# Altium schematic sheet controle_motor_official.SchDoc
size A4; SheetNumber: 1; SheetTotal: 4
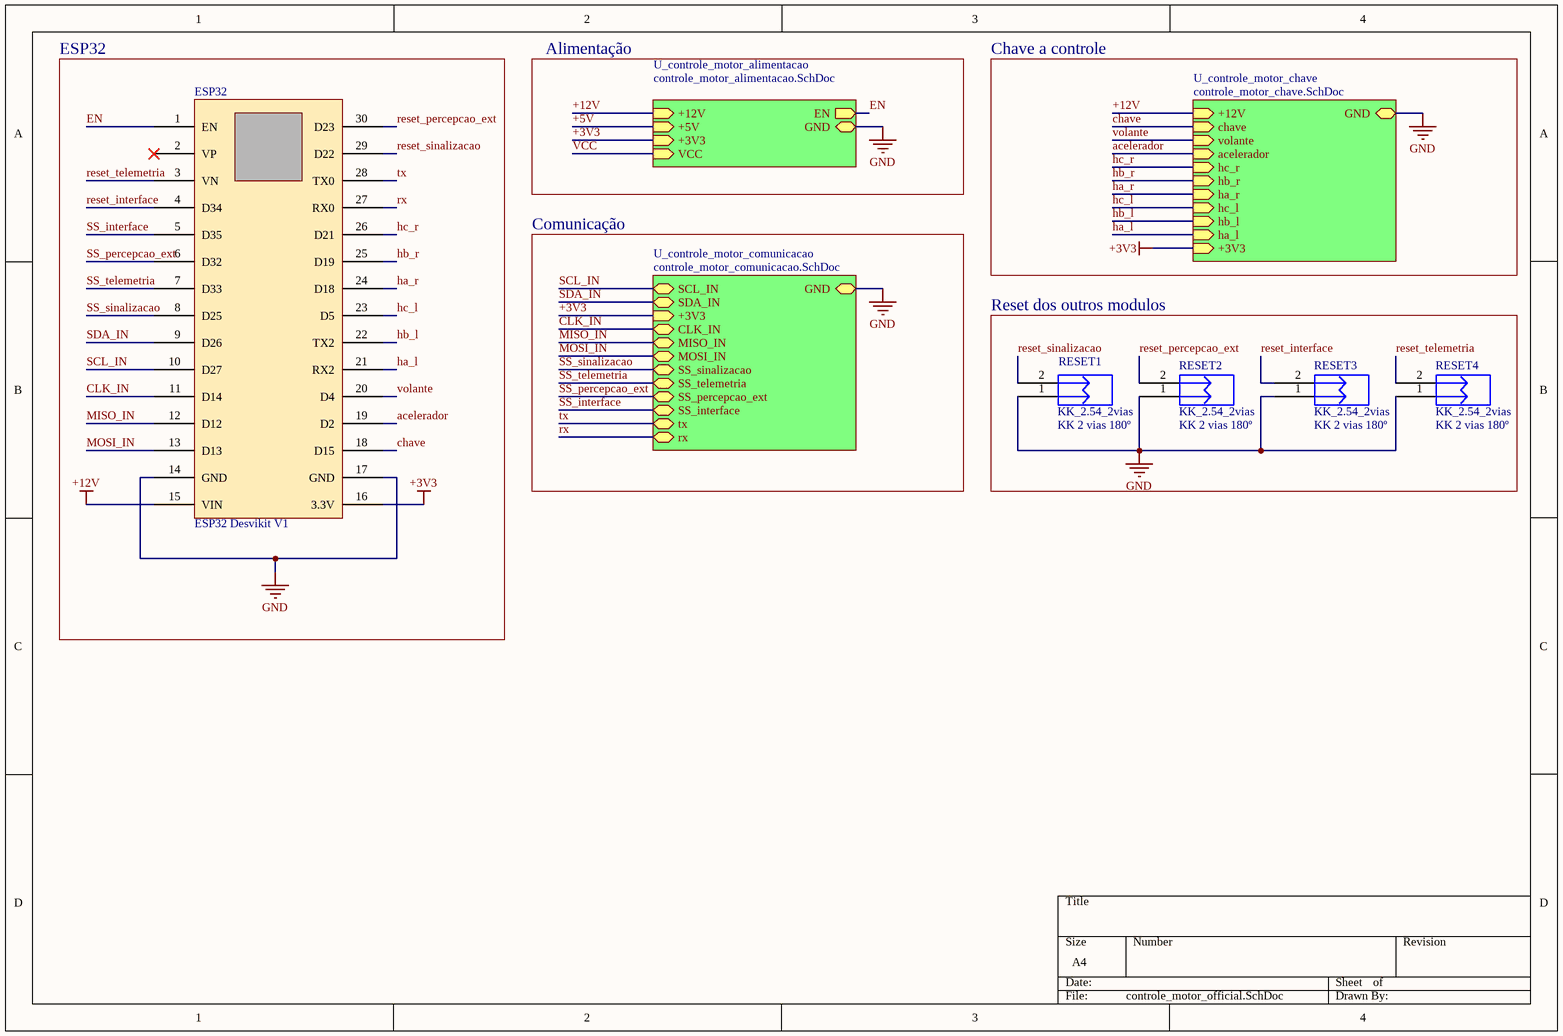
[diagram p0: controle_motor_official.SchDoc]

## Parts
ESP32  value ESP32 Desvikit V1  [ESP32_Desvikit_v1]  (hidden comment: microcontrolador)
RESET1  KK_2.54_2vias  Valor: KK 2 vias 180º  [KK_2VIAS_180º]
RESET2  KK_2.54_2vias  Valor: KK 2 vias 180º  [KK_2VIAS_180º]
RESET3  KK_2.54_2vias  Valor: KK 2 vias 180º  [KK_2VIAS_180º]
RESET4  KK_2.54_2vias  Valor: KK 2 vias 180º  [KK_2VIAS_180º]

## Blocks framed on the sheet
ESP32: ESP32
Reset dos outros modulos: RESET1-RESET4

## Sub-sheets
U_controle_motor_alimentacao = controle_motor_alimentacao.SchDoc: EN (out), GND (bidir), +12V (in), +5V (in), +3V3 (in), VCC (in)
U_controle_motor_chave = controle_motor_chave.SchDoc: GND (bidir), +12V (in), chave (in), volante (in), acelerador (in), hc_r (in), hb_r (in), ha_r (in), hc_l (in), hb_l (in), ha_l (in), +3V3 (in)
U_controle_motor_comunicacao = controle_motor_comunicacao.SchDoc: SCL_IN (bidir), SDA_IN (bidir), GND (bidir), +3V3 (in), CLK_IN (bidir), MISO_IN (bidir), MOSI_IN (bidir), SS_sinalizacao (bidir), SS_telemetria (bidir), SS_percepcao_ext (bidir), SS_interface (bidir), tx (bidir), rx (bidir)

## Nets
+3V3: ESP32.16(3.3V) ; sheet U_controle_motor_alimentacao/+3V3, sheet U_controle_motor_chave/+3V3, sheet U_controle_motor_comunicacao/+3V3
+12V: ESP32.15(VIN) ; sheet U_controle_motor_alimentacao/+12V, sheet U_controle_motor_chave/+12V
GND: ESP32.14(GND) ESP32.17(GND) RESET1.1 RESET2.1 RESET3.1 RESET4.1 ; sheet U_controle_motor_alimentacao/GND, sheet U_controle_motor_chave/GND, sheet U_controle_motor_comunicacao/GND
+5V: sheet U_controle_motor_alimentacao/+5V
acelerador: ESP32.19(D2) ; sheet U_controle_motor_chave/acelerador
chave: ESP32.18(D15) ; sheet U_controle_motor_chave/chave
CLK_IN: ESP32.11(D14) ; sheet U_controle_motor_comunicacao/CLK_IN
EN: ESP32.1(EN) ; sheet U_controle_motor_alimentacao/EN
ha_l: ESP32.21(RX2) ; sheet U_controle_motor_chave/ha_l
ha_r: ESP32.24(D18) ; sheet U_controle_motor_chave/ha_r
hb_l: ESP32.22(TX2) ; sheet U_controle_motor_chave/hb_l
hb_r: ESP32.25(D19) ; sheet U_controle_motor_chave/hb_r
hc_l: ESP32.23(D5) ; sheet U_controle_motor_chave/hc_l
hc_r: ESP32.26(D21) ; sheet U_controle_motor_chave/hc_r
MISO_IN: ESP32.12(D12) ; sheet U_controle_motor_comunicacao/MISO_IN
MOSI_IN: ESP32.13(D13) ; sheet U_controle_motor_comunicacao/MOSI_IN
reset_interface: ESP32.4(D34) RESET3.2
reset_percepcao_ext: ESP32.30(D23) RESET2.2
reset_sinalizacao: ESP32.29(D22) RESET1.2
reset_telemetria: ESP32.3(VN) RESET4.2
rx: ESP32.27(RX0) ; sheet U_controle_motor_comunicacao/rx
SCL_IN: ESP32.10(D27) ; sheet U_controle_motor_comunicacao/SCL_IN
SDA_IN: ESP32.9(D26) ; sheet U_controle_motor_comunicacao/SDA_IN
SS_interface: ESP32.5(D35) ; sheet U_controle_motor_comunicacao/SS_interface
SS_percepcao_ext: ESP32.6(D32) ; sheet U_controle_motor_comunicacao/SS_percepcao_ext
SS_sinalizacao: ESP32.8(D25) ; sheet U_controle_motor_comunicacao/SS_sinalizacao
SS_telemetria: ESP32.7(D33) ; sheet U_controle_motor_comunicacao/SS_telemetria
tx: ESP32.28(TX0) ; sheet U_controle_motor_comunicacao/tx
VCC: sheet U_controle_motor_alimentacao/VCC
volante: ESP32.20(D4) ; sheet U_controle_motor_chave/volante

Not connected (* = marked no-connect by the designer): ESP32 2(VP)*

## Notes on the sheet
- Alimentação
- Chave a controle
- Comunicação

## Library data of the parts
ESP32 = ESP32 Desvikit v1: microcontrolador com moculo bluethoth e wifi
RESET1-RESET4 = KK_2.54_2vias: Conector KK 2.54mm 2 vias; Descrição: Conector KK 3 vias com passo 2.54mm; Encapsulamento: PTH - 180º; Modelo: 2 vias - 180º; Marca: *; Observação: *